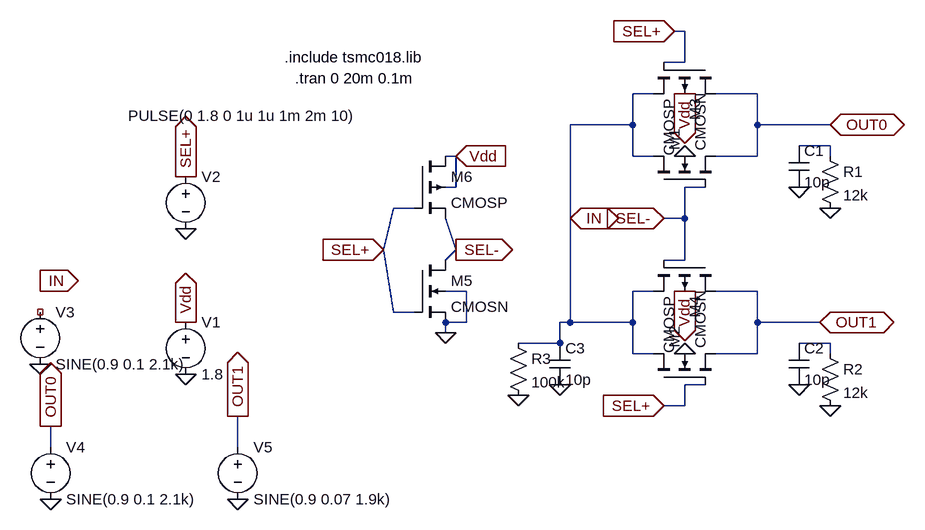
[diagram p0: schematic transmission gate.asc]
transmission gate.asc, the LTspice schematic file:
Version 4
SHEET 1 880 848
WIRE 496 112 480 112
WIRE 496 160 496 112
WIRE 496 160 464 160
WIRE 448 208 416 208
WIRE 608 208 544 208
WIRE 416 256 416 208
WIRE 416 256 320 256
WIRE 608 256 608 208
WIRE 720 256 608 256
WIRE 720 288 672 288
WIRE 144 304 128 304
WIRE 416 304 416 256
WIRE 448 304 416 304
WIRE 608 304 608 256
WIRE 608 304 544 304
WIRE 720 304 720 288
WIRE 144 352 144 304
WIRE 144 352 128 352
WIRE 528 352 496 352
WIRE 80 384 48 384
WIRE 320 400 320 256
WIRE 496 400 496 352
WIRE 496 400 464 400
WIRE 32 448 48 384
WIRE 144 448 128 400
WIRE 128 464 144 448
WIRE 496 464 496 400
WIRE 496 464 464 464
WIRE 160 512 128 512
WIRE 448 512 416 512
WIRE 608 512 544 512
WIRE 48 544 32 448
WIRE 80 544 48 544
WIRE 160 560 160 512
WIRE 160 560 128 560
WIRE 320 560 320 400
WIRE 320 560 304 560
WIRE 416 560 416 512
WIRE 416 560 320 560
WIRE 608 560 608 512
WIRE 704 560 608 560
WIRE 128 576 128 560
WIRE 304 592 304 560
WIRE 304 592 240 592
WIRE 720 592 672 592
WIRE 416 608 416 560
WIRE 448 608 416 608
WIRE 608 608 608 560
WIRE 608 608 544 608
WIRE 720 608 720 592
WIRE 528 656 496 656
WIRE 496 688 496 656
WIRE 496 688 464 688
WIRE -480 752 -480 720
WIRE -192 752 -192 704
FLAG 496 304 0
FLAG 496 608 0
FLAG -272 560 Vdd
IOPIN -272 560 Out
FLAG 496 208 Vdd
IOPIN 496 208 Out
FLAG 496 512 Vdd
IOPIN 496 512 Out
FLAG 320 400 IN
IOPIN 320 400 BiDir
FLAG 480 112 SEL+
IOPIN 480 112 In
FLAG 464 400 SEL-
IOPIN 464 400 In
FLAG 464 688 SEL+
IOPIN 464 688 In
FLAG 720 256 OUT0
IOPIN 720 256 BiDir
FLAG 704 560 OUT1
IOPIN 704 560 BiDir
FLAG -272 640 0
FLAG 144 304 Vdd
IOPIN 144 304 In
FLAG 128 576 0
FLAG 32 448 SEL+
IOPIN 32 448 In
FLAG 144 448 SEL-
IOPIN 144 448 Out
FLAG -272 336 SEL+
IOPIN -272 336 Out
FLAG -272 416 0
FLAG -496 496 IN
IOPIN -496 496 Out
FLAG -496 624 0
FLAG 672 352 0
FLAG 672 656 0
FLAG 720 384 0
FLAG 720 688 0
FLAG -480 720 OUT0
IOPIN -480 720 Out
FLAG -480 832 0
FLAG -192 704 OUT1
IOPIN -192 704 Out
FLAG -192 832 0
FLAG 240 672 0
FLAG 304 656 0
SYMBOL cmosn 448 352 R270
SYMATTR InstName M1
SYMATTR Value2 l=0.18u w=0.48u
SYMBOL cmosn 448 656 R270
SYMATTR InstName M2
SYMATTR Value2 l=0.18u w=0.48u
SYMBOL cmosp 544 160 R90
SYMATTR InstName M3
SYMATTR Value2 l=0.18u w=0.84u
SYMBOL cmosp 544 464 R90
SYMATTR InstName M4
SYMATTR Value2 l=0.18u w=0.84u
SYMBOL voltage -272 544 R0
SYMATTR InstName V1
SYMATTR Value 1.8
SYMBOL cmosn 80 464 R0
SYMATTR InstName M5
SYMATTR Value2 l=180n w=180n
SYMBOL cmosp 80 304 R0
SYMATTR InstName M6
SYMATTR Value2 l=180n w=480n
SYMBOL voltage -272 320 R0
WINDOW 3 -89 -78 Left 2
SYMATTR Value PULSE(0 1.8 0 1u 1u 1m 2m 10)
SYMATTR InstName V2
SYMBOL voltage -496 528 R0
SYMATTR InstName V3
SYMATTR Value SINE(0.9 0.1 2.1k)
SYMBOL cap 656 288 R0
SYMATTR InstName C1
SYMATTR Value 10p
SYMBOL cap 656 592 R0
SYMATTR InstName C2
SYMATTR Value 10p
SYMBOL res 704 288 R0
SYMATTR InstName R1
SYMATTR Value 12k
SYMBOL res 704 592 R0
SYMATTR InstName R2
SYMATTR Value 12k
SYMBOL voltage -480 736 R0
SYMATTR InstName V4
SYMATTR Value SINE(0.9 0.1 2.1k)
SYMBOL voltage -192 736 R0
SYMATTR InstName V5
SYMATTR Value SINE(0.9 0.07 1.9k)
SYMBOL cap 288 592 R0
SYMATTR InstName C3
SYMATTR Value 10p
SYMBOL res 224 576 R0
SYMATTR InstName R3
SYMATTR Value 100k
TEXT -120 152 Left 2 !.include tsmc018.lib
TEXT -104 184 Left 2 !.tran 0 20m 0.1m

The netlist it stands for:
* transmission gate.asc
M1 IN SEL- OUT0 0 CMOSN l=0.18u w=0.48u
M2 IN SEL+ OUT1 0 CMOSN l=0.18u w=0.48u
M3 OUT0 SEL+ IN Vdd CMOSP l=0.18u w=0.84u
M4 OUT1 SEL- IN Vdd CMOSP l=0.18u w=0.84u
V1 Vdd 0 1.8
M5 SEL- SEL+ 0 0 CMOSN l=180n w=180n
M6 Vdd SEL+ SEL- Vdd CMOSP l=180n w=480n
V2 SEL+ 0 PULSE(0 1.8 0 1u 1u 1m 2m 10)
V3 NC_01 0 SINE(0.9 0.1 2.1k)
C1 N001 0 10p
C2 N002 0 10p
R1 N001 0 12k
R2 N002 0 12k
V4 OUT0 0 SINE(0.9 0.1 2.1k)
V5 OUT1 0 SINE(0.9 0.07 1.9k)
C3 IN 0 10p
R3 IN 0 100k
.model NMOS NMOS
.model PMOS PMOS
.lib standard.mos
.include tsmc018.lib
.tran 0 20m 0.1m
.backanno
.end